# Altium schematic sheet PESD3V3L1BA-N1_PESD3V3L1BA-N.schdoc.schdoc
size 127 x 99 mm
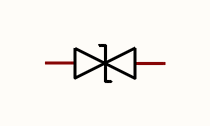
[diagram p0: PESD3V3L1BA-N1_PESD3V3L1BA-N.schdoc.schdoc]

## Parts
D?  PESD3V3L1BA-N  [SOD-323_L1.8-W1.3-LS2.5-BI]  (value not drawn)

## Nets

Not connected (* = marked no-connect by the designer): D? 1 2

## Library data of the parts
D? = PESD3V3L1BA-N: Manufacturer: BORN(伯恩半导体); Add into BOM: yes; Symbol: PESD3V3L1BA-N; Device: PESD3V3L1BA-N; Supplier: LCSC; Supplier Part: C316020; Manufacturer Part: PESD3V3L1BA-N; JLCPCB Part Class: Extended Part; LCSC Part Name: PESD3V3L1BA-N; Supplier Footprint: SOD-323; Datasheet: https://atta.szlcsc.com/upload/public/pdf/source/20181025/C316020_2B145715011D530A3B5DDCE0F9684BA2.pdf; Convert to PCB: yes